# EAGLE design IGUINOBOARD (EAGLE 9.0.1)
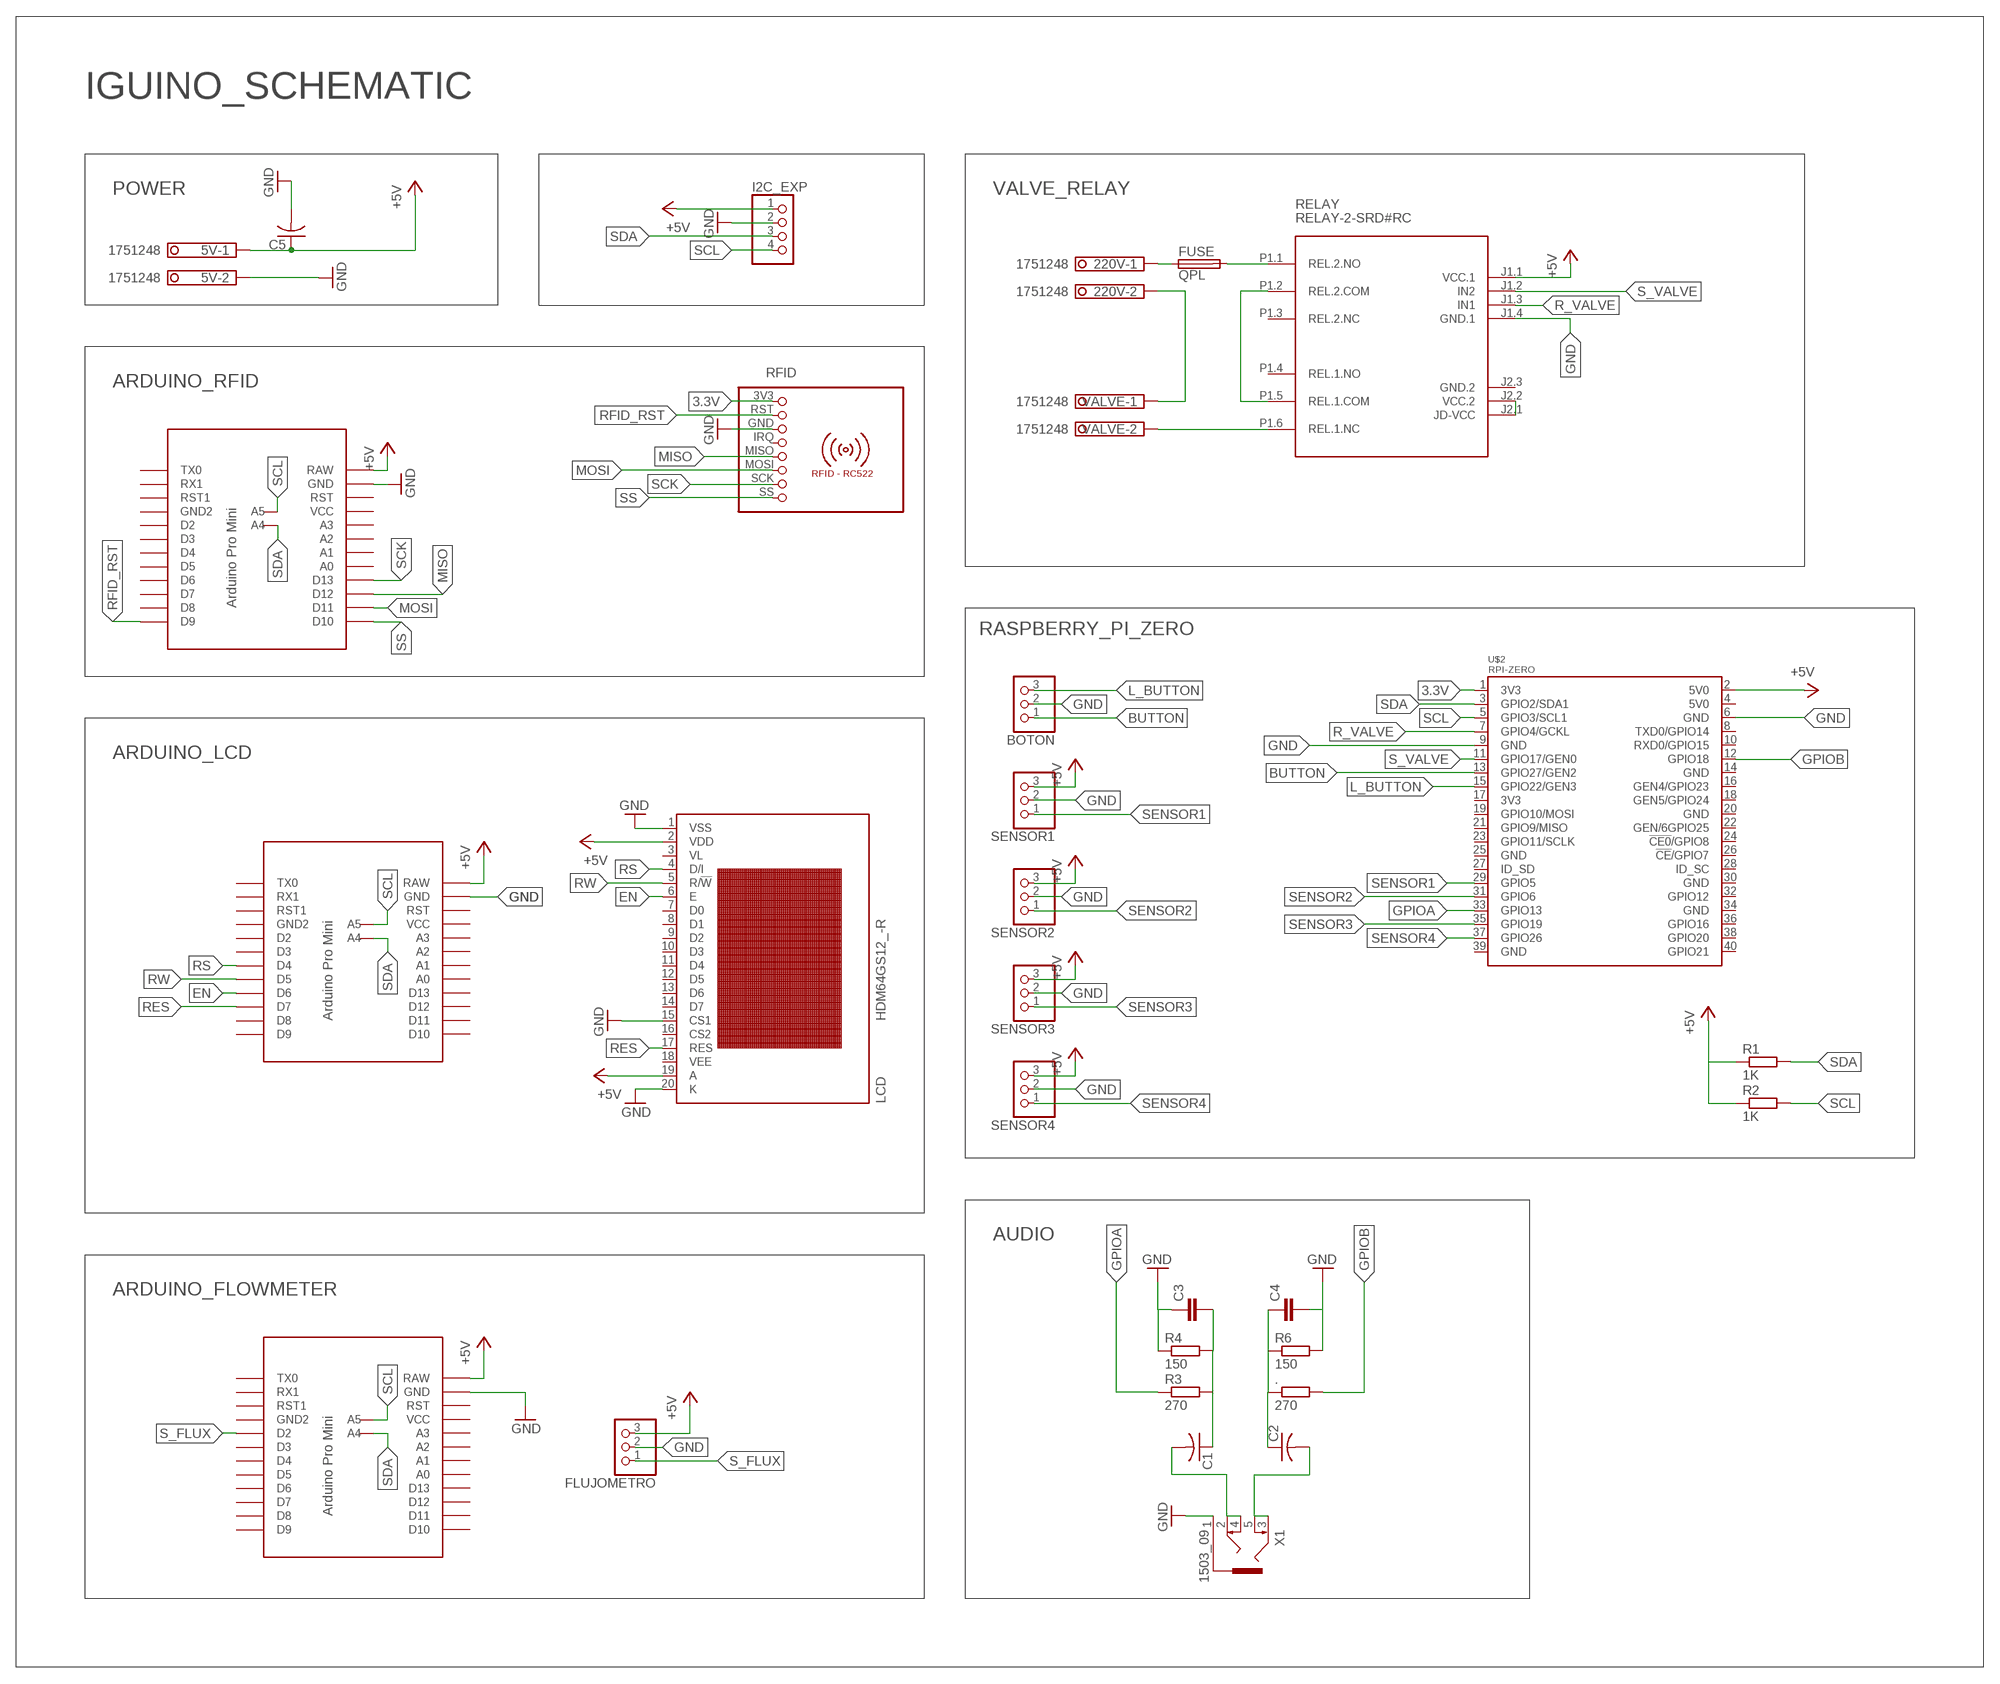
[diagram p0: schematic, sheet 1]

## Parts
5V  1751248  [1751248]
220V  1751248  [1751248]
.  270  R-EU_0204/7  [0204/7]
BOTON  PINHD-1X3  [1X03]
C1  C-US025-024X044  [C025-024X044]
C2  C-US025-024X044  [C025-024X044]
C3  C-EU025-030X050  [C025-030X050]
C4  C-EU025-030X050  [C025-030X050]
C5  C-US025-024X044  [C025-024X044]
FLUJOMETRO  PINHD-1X3  [1X03]
FUSE  QPL  [QPL]
I2C_EXP  PINHD-1X4  [1X04]
LCD  HDM64GS12_-R  [HDM64GS12_-R]
R1  1K  R-EU_0204/7  [0204/7]
R2  1K  R-EU_0204/7  [0204/7]
R3  270  R-EU_0204/7  [0204/7]
R4  150  R-EU_0204/7  [0204/7]
R6  150  R-EU_0204/7  [0204/7]
RELAY  RELAY-2-SRD#RC  [RELAY-2-SRD#RC]
RFID  RFID-RC522  [RFID-RC522]
SENSOR1  PINHD-1X3  [1X03]
SENSOR2  PINHD-1X3  [1X03]
SENSOR3  PINHD-1X3  [1X03]
SENSOR4  PINHD-1X3  [1X03]
U$1  PRO-MINI-2  [PRO-MINI-2]
U$2  RPI-ZERO  [RASP_PI_ZERO_BOARD_FULL]
U$5  PRO-MINI-2  [PRO-MINI-2]
U$6  PRO-MINI-2  [PRO-MINI-2]
VALVE  1751248  [1751248]
X1  1503_09  [1503_09]

## Nets
3.3V: RFID.3V3 U$2.1(3V3)
+5V: 5V.1 C5.1 FLUJOMETRO.3 I2C_EXP.1 LCD.2(VDD) LCD.19(A) R1.1 R2.1 RELAY.J1.1(VCC.1) SENSOR1.3 SENSOR2.3 SENSOR3.3 SENSOR4.3 U$1.RAW U$2.2(5V0) U$5.RAW U$6.RAW
BUTTON: BOTON.1 U$2.13(GPIO27/GEN2)
EN: LCD.6(E) U$5.D6
GND: 5V.2 BOTON.2 C3.1 C4.2 C5.2 FLUJOMETRO.2 I2C_EXP.2 LCD.1(VSS) LCD.15(CS1) LCD.20(K) R4.1 R6.2 RELAY.J1.4(GND.1) RFID.GND SENSOR1.2 SENSOR2.2 SENSOR3.2 SENSOR4.2 U$1.GND U$2.6(GND) U$2.9(GND) U$5.GND U$6.GND X1.1
GPIOA: R3.1 U$2.33(GPIO13)
GPIOB: ..2 U$2.12(GPIO18)
L_BUTTON: BOTON.3 U$2.15(GPIO22/GEN3)
MISO: RFID.MISO U$6.D12
MOSI: RFID.MOSI U$6.D11
N$1: RELAY.P1.6(REL.1.NC) VALVE.2
N$2: C1.1 C3.2 R3.2 R4.2
N$3: ..1 C2.1 C4.1 R6.1
N$4: C1.2 X1.2 X1.4
N$5: C2.2 X1.3 X1.5
N$11: 220V.1 FUSE.1
N$12: RELAY.P1.2(REL.2.COM) RELAY.P1.5(REL.1.COM)
N$14: FUSE.2 RELAY.P1.1(REL.2.NO)
N$15: 220V.2 VALVE.1
N$16: RELAY.J2.1(JD-VCC) RELAY.J2.2(VCC.2)
R_VALVE: RELAY.J1.3(IN1) U$2.7(GPIO4/GCKL)
RES: LCD.17(RES) U$5.D7
RFID_RST: RFID.RST U$6.D9
RS: LCD.4(D/I) U$5.D4
RW: LCD.5(R/!W) U$5.D5
S_FLUX: FLUJOMETRO.1 U$1.D2
S_VALVE: RELAY.J1.2(IN2) U$2.11(GPIO17/GEN0)
SCK: RFID.SCK U$6.D13
SCL: I2C_EXP.4 R2.2 U$1.A5 U$2.5(GPIO3/SCL1) U$5.A5 U$6.A5
SDA: I2C_EXP.3 R1.2 U$1.A4 U$2.3(GPIO2/SDA1) U$5.A4 U$6.A4
SENSOR1: SENSOR1.1 U$2.29(GPIO5)
SENSOR2: SENSOR2.1 U$2.31(GPIO6)
SENSOR3: SENSOR3.1 U$2.35(GPIO19)
SENSOR4: SENSOR4.1 U$2.37(GPIO26)
SS: RFID.SS U$6.D10
Unconnected: LCD.3(VL) LCD.7(D0) LCD.8(D1) LCD.9(D2) LCD.10(D3) LCD.11(D4) LCD.12(D5) LCD.13(D6) LCD.14(D7) LCD.16(CS2) LCD.18(VEE) RELAY.P1.3(REL.2.NC) RELAY.P1.4(REL.1.NO) RFID.IRQ U$1.A0 U$1.A1 U$1.A2 U$1.A3 U$1.D3 U$1.D4 U$1.D5 U$1.D6 U$1.D7 U$1.D8 U$1.D9 U$1.D10 U$1.D11 U$1.D12 U$1.D13 U$1.GND1(GND2) U$1.RST U$1.RST1 U$1.RX1 U$1.TX0 U$1.VCC U$2.4(5V0) U$2.8(TXD0/GPIO14) U$2.10(RXD0/GPIO15) U$2.14(GND) U$2.16(GEN4/GPIO23) U$2.17(3V3) U$2.18(GEN5/GPIO24) U$2.19(GPIO10/MOSI) U$2.20(GND) U$2.21(GPIO9/MISO) U$2.22(GEN/6GPIO25) U$2.23(GPIO11/SCLK) U$2.24(!CE0!/GPIO8) U$2.25(GND) U$2.26(!CE!/GPIO7) U$2.27(ID_SD) U$2.28(ID_SC) U$2.30(GND) U$2.32(GPIO12) U$2.34(GND) U$2.36(GPIO16) U$2.38(GPIO20) U$2.39(GND) U$2.40(GPIO21) U$5.A0 U$5.A1 U$5.A2 U$5.A3 U$5.D2 U$5.D3 U$5.D8 U$5.D9 U$5.D10 U$5.D11 U$5.D12 U$5.D13 U$5.GND1(GND2) U$5.RST U$5.RST1 U$5.RX1 U$5.TX0 U$5.VCC U$6.A0 U$6.A1 U$6.A2 U$6.A3 U$6.D2 U$6.D3 U$6.D4 U$6.D5 U$6.D6 U$6.D7 U$6.D8 U$6.GND1(GND2) U$6.RST U$6.RST1 U$6.RX1 U$6.TX0 U$6.VCC

## Notes on the sheet
- IGUINO_SCHEMATIC
- POWER | VALVE_RELAY
- ARDUINO_RFID
- RASPBERRY_PI_ZERO
- ARDUINO_LCD
- AUDIO
- ARDUINO_FLOWMETER

## Power pins joined to a net without a drawn wire
GND.2: RELAY.J2.3(GND.2)

## Library data of the parts
5V 220V VALVE = con-phoenix-350:1751248: MKDS 1/ 2-3,5 Printklemme Nennstrom: 10 A Bemessungsspannung: 160 V Raster: 3,5 mm Polzahl: 2 Montageart: Löten Anschlussart: Schraubanschluss Anschlussrichtung vom Leiter zur Platine: 0° Source: http://eshop.phoenixcontact.com .. 1751248.pdf; OC_FARNELL: unknown; OC_NEWARK: unknown
. R1-R4 R6 = rcl:R-EU_: RESISTOR, European symbol; SPICEPREFIX: R
BOTON FLUJOMETRO SENSOR1-SENSOR4 = pinhead:PINHD-1X3: PIN HEADER
C1 C2 C5 = rcl:C-US: CAPACITOR, American symbol; SPICEPREFIX: C
C3 C4 = rcl:C-EU: CAPACITOR, European symbol; SPICEPREFIX: C
FUSE = fuse:QPL: Fuseholder for Micro(TM) Fuse or Pico(R) II Fuses 281 005, 281 008 Source:www.littlefuse.com .. 281005A.PDF; OC_FARNELL: 1608231; OC_NEWARK: unknown
I2C_EXP = pinhead:PINHD-1X4: PIN HEADER
LCD = display-lcd-2:HDM64GS12_-R: HDM64GS12_-R 128 X 64 Dots Graphic Source: http://www.hantronix.com/down/64gs12-r.pdf; OC_FARNELL: unknown; OC_NEWARK: unknown
RELAY = diy-modules:RELAY-2-SRD#RC: 2-Channel Relay Module based on SRD-05VDC-SL-C relays Symbol with relays pins Click here to find device on ebay.com <http://www.ebay.com/sch/two+channel+relay+module+optocoupler+5v>
RFID = mfrc522-module:RFID-RC522: RFID-RC522 MFRC-522 based breakout board
U$1 U$5 U$6 = Arduino-clone2:PRO-MINI-2: Arduino Pro Mini Layout 2 Sparkfun.com
U$2 = rpi-zero:RPI-ZERO
X1 = con-lumberg-2:1503_09: Jack connectors according to JISC 6560, 3.5 mm Klinkeneinbaukupplung nach JISC 6560, 3,5 mm, 3-polig/ stereo, abgewinkelte Ausführung, mit 2 Öffnern und Lötaugen, für Leiterplatten Rückseitenmontage Source: http://www.lumberg.com/Produkte/PDFs/1503_09.pdf; OC_FARNELL: 1243244; OC_NEWARK: unknown

## Board
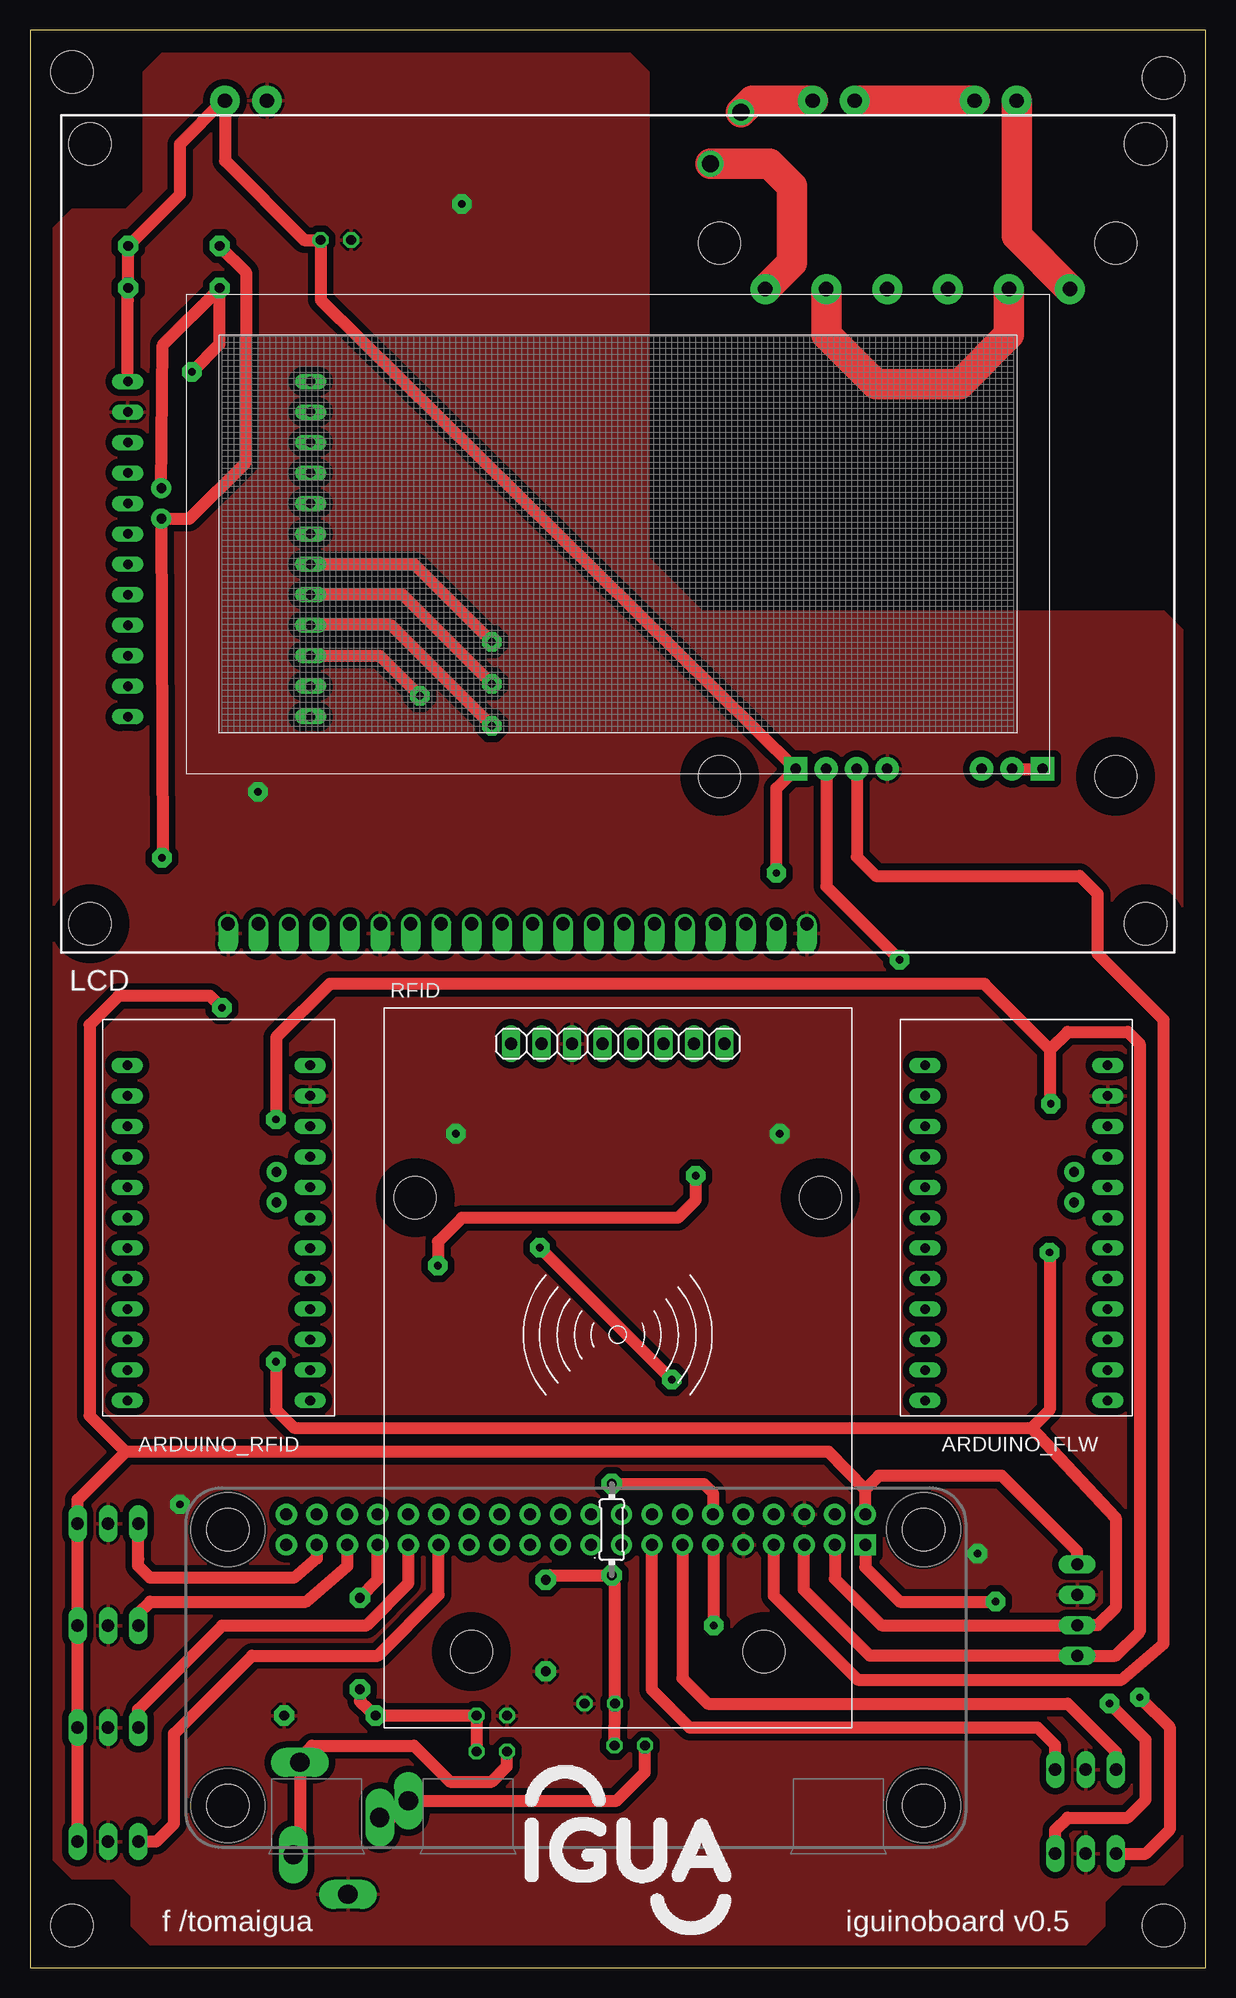
[diagram p1: board, top side]
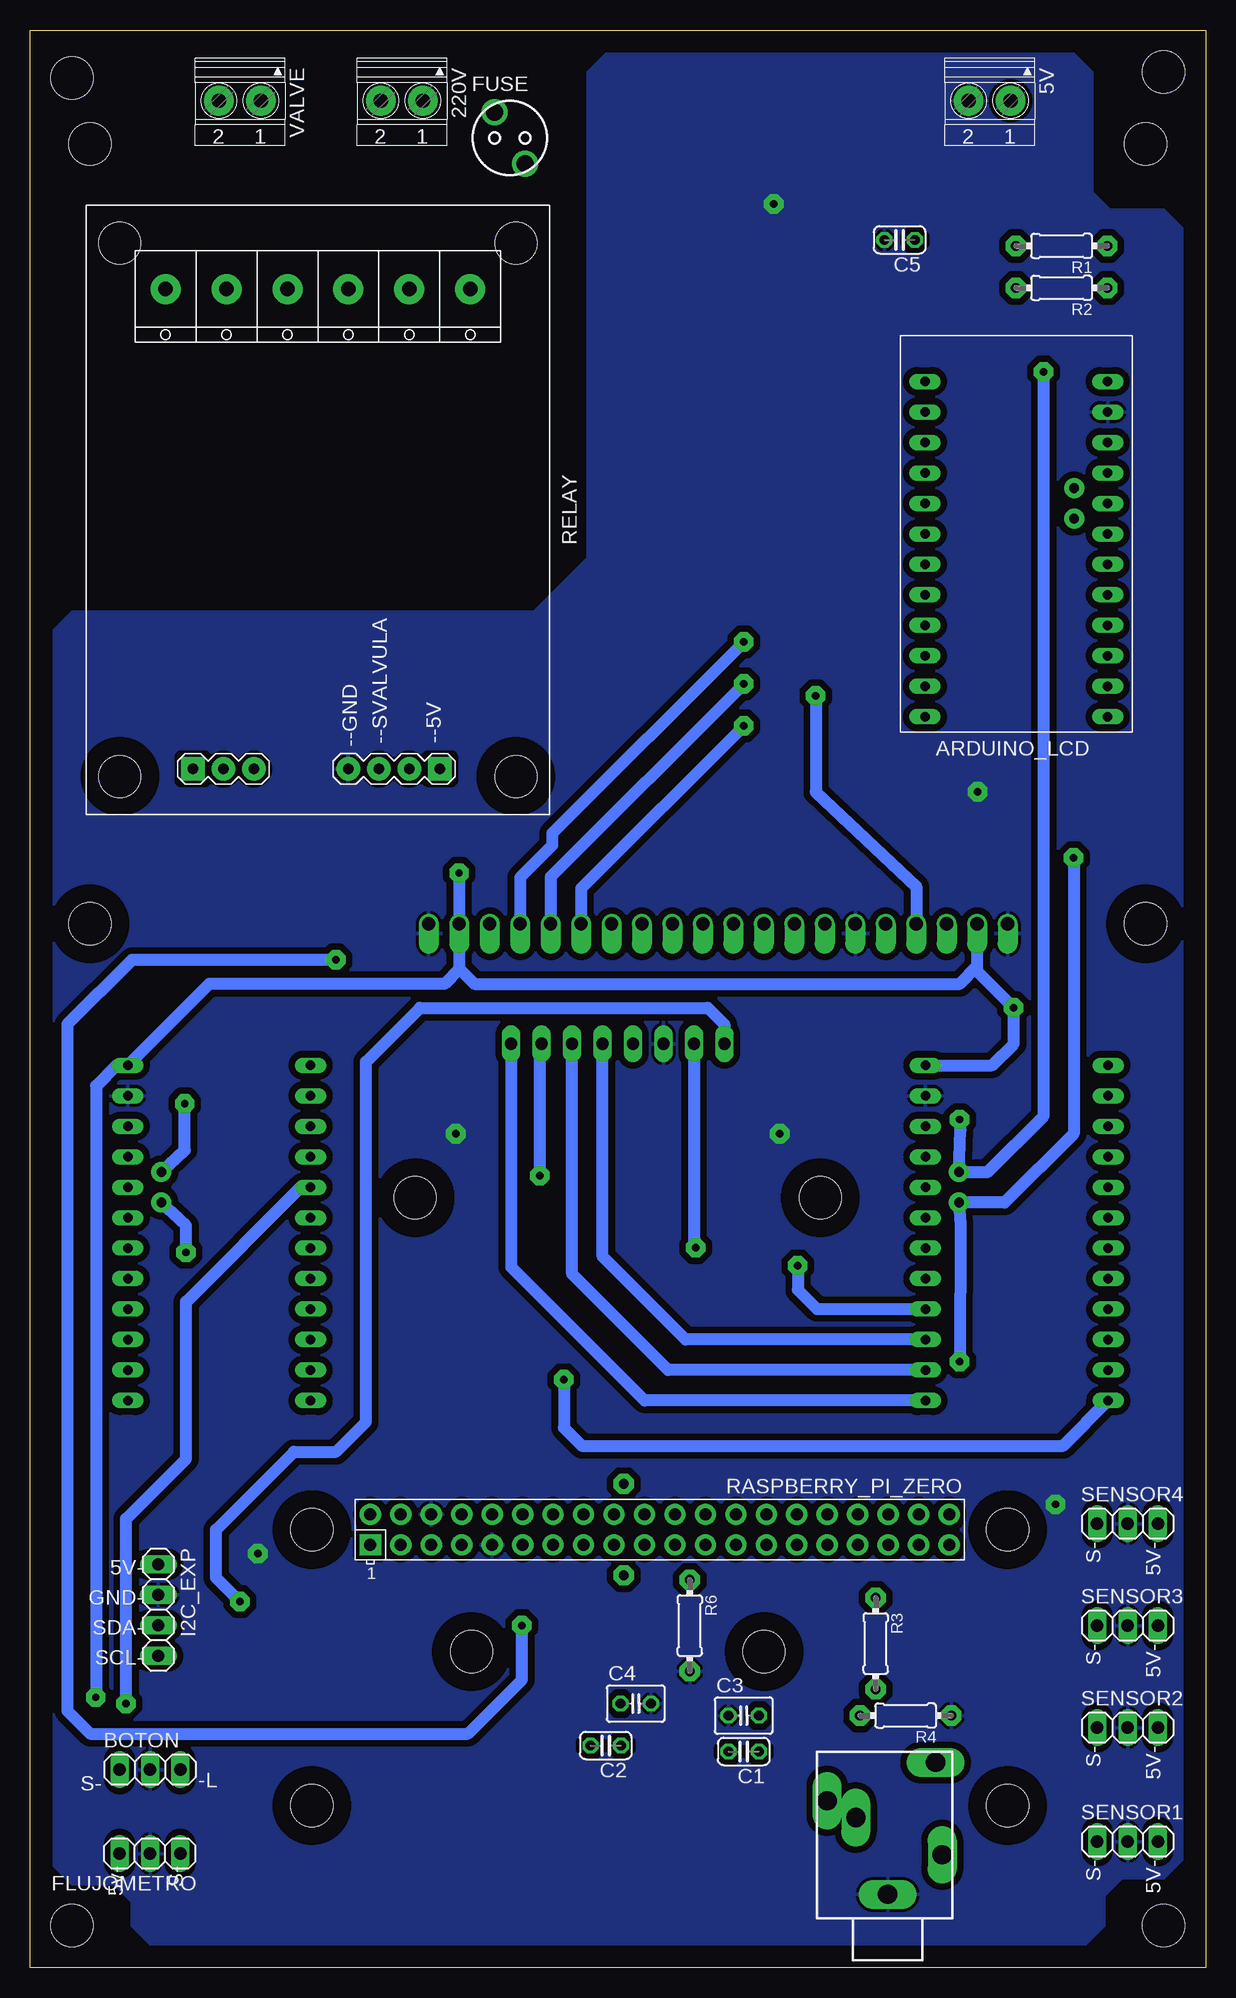
[diagram p2: board, bottom side, seen from below]

Size 98 x 161.5 mm. Coordinates in mm from the lower left corner, seen from the top.
Outline: 0,0 98,0 98,161.5 0,161.5 0,0
Copper layers (1*16): Top 0.035mm / dielectric 1.5mm / Bottom 0.035mm
Design rules "default *": minimum track width 40mil, minimum drill 40mil, track to track 22mil, track to pad 22mil, pad to pad 22mil, via to via 22mil, smd to smd 6mil, copper to edge 60mil, drill to drill 8mil, minimum pad ring 10mil, minimum via ring 8mil, stop-mask expansion 4mil, vias tented up to drill 0mil, thermal gap 10mil
Holes 3.5 mm at 3.5,3.5 94.5,3.5 94.5,157.5 3.5,158

### Footprints (pad centres in the part's own frame; a part is rotated, then mirrored left to right if it is on the bottom)
1751248 = drill 1.194 pad 2.489: 1 -1.75,-0.1; 2 1.75,-0.1
0204/7 = drill 0.813 pad 1.676 octagon: 1 -3.81,0; 2 3.81,0
1X03 = drill 1.016 long: 1 -2.54,0; 2 0,0; 3 2.54,0
C025-024X044 = drill 0.813 octagon: 1 -1.27,0; 2 1.27,0
C025-030X050 = drill 0.813 octagon: 1 -1.27,0; 2 1.27,0
QPL = drill 1.4 pad 2.184: 1 -1.27,2.139; 2 1.27,-2.139
1X04 = drill 1.016 long: 1 -3.81,0; 2 -1.27,0; 3 1.27,0; 4 3.81,0
HDM64GS12_-R = drill 1.1 offset: 1 15.76,-32.5; 2 13.22,-32.5; 3 10.68,-32.5; 4 8.14,-32.5; 5 5.6,-32.5; 6 3.06,-32.5; 7 0.52,-32.5; 8 -2.02,-32.5; 9 -4.56,-32.5; 10 -7.1,-32.5; 11 -9.64,-32.5; 12 -12.18,-32.5; 13 -14.72,-32.5; 14 -17.26,-32.5; 15 -19.8,-32.5; 16 -22.34,-32.5; 17 -24.88,-32.5; 18 -27.42,-32.5; 19 -29.96,-32.5; 20 -32.5,-32.5 | hole 3.5: -44,-32.5; 44,-32.5; -44,32.5; 44,32.5
RELAY-2-SRD#RC = drill 0.889 pad 1.956 square: J1.1 21.59,10.16; J2.1 21.59,-10.414 | drill 0.889 pad 1.956: J1.2 21.59,7.62; J1.3 21.59,5.08; J1.4 21.59,2.54; J2.2 21.59,-7.874; J2.3 21.59,-5.334 | drill 1.2 pad 2.5: P1.1 -18.415,12.7; P1.2 -18.415,7.62; P1.3 -18.415,2.54; P1.4 -18.415,-2.54; P1.5 -18.415,-7.62; P1.6 -18.415,-12.7 | hole 3.5: -22.225,16.51; 22.225,16.51; 22.225,-16.51; -22.225,-16.51
RFID-RC522 = drill 1.016 long: 3V3 -8.89,0; GND -3.81,0; IRQ -1.27,0; MISO 1.27,0; MOSI 3.81,0; RST -6.35,0; SCK 6.35,0; SS 8.89,0 | hole 3.5: -12.192,-50.673; 12.192,-50.673; -16.891,-12.827; 16.891,-12.827
PRO-MINI-2 = drill 0.8 long: A0 6.35,2.54; A1 6.35,0; A2 6.35,-2.54; A3 6.35,-5.08; D2 -8.89,2.54; D3 -8.89,0; D4 -8.89,-2.54; D5 -8.89,-5.08; D6 -8.89,-7.62; D7 -8.89,-10.16; D8 -8.89,-12.7; D9 -8.89,-15.24; D10 6.35,-15.24; D11 6.35,-12.7; D12 6.35,-10.16; D13 6.35,-7.62; GND 6.35,10.16; GND1 -8.89,5.08; RAW 6.35,12.7; RST 6.35,7.62; RST1 -8.89,7.62; RX1 -8.89,10.16; TX0 -8.89,12.7; VCC 6.35,5.08 | drill 0.8 pad 1.676: A4 3.556,1.27; A5 3.556,3.81
RASP_PI_ZERO_BOARD_FULL = drill 1 pad 1.778 square: 1 8.37,25.23 | drill 1 pad 1.778: 2 8.37,27.77; 3 10.91,25.23; 4 10.91,27.77; 5 13.45,25.23; 6 13.45,27.77; 7 15.99,25.23; 8 15.99,27.77; 9 18.53,25.23; 10 18.53,27.77; 11 21.07,25.23; 12 21.07,27.77; 13 23.61,25.23; 14 23.61,27.77; 15 26.15,25.23; 16 26.15,27.77; 17 28.69,25.23; 18 28.69,27.77; 19 31.23,25.23; 20 31.23,27.77; 21 33.77,25.23; 22 33.77,27.77; 23 36.31,25.23; 24 36.31,27.77; 25 38.85,25.23; 26 38.85,27.77; 27 41.39,25.23; 28 41.39,27.77; 29 43.93,25.23; 30 43.93,27.77; 31 46.47,25.23; 32 46.47,27.77; 33 49.01,25.23; 34 49.01,27.77; 35 51.55,25.23; 36 51.55,27.77; 37 54.09,25.23; 38 54.09,27.77; 39 56.63,25.23; 40 56.63,27.77 | hole 3.5: 3.5,3.5; 3.5,26.5; 61.5,3.5; 61.5,26.5
1503_09 = drill 1.6 pad 2 long: 1 0,-2.1; 2 -4.55,-5.4; 3 5.05,-9.9; 4 -4,-13.1; 5 2.65,-8.5

### Placement (x,y rotation side)
5V  18,155.5 180 bottom
220V  67,155.5 180 bottom
.  48.5,36.5 90 top
BOTON  88,16.5 0 bottom
C1  38.5,18 180 bottom
C2  50,18.5 180 bottom
C3  38.5,21 0 bottom
C4  47.5,22 0 bottom
C5  25.5,144 180 bottom
FLUJOMETRO  88,9.5 180 bottom
FUSE  58,152.5 0 bottom
I2C_EXP  87.3,29.8 270 bottom
LCD  49,119.5 0 top
R1  12,143.5 180 bottom
R2  12,140 180 bottom
R3  27.5,27 270 bottom
R4  25,21 180 bottom
R6  43,28.5 270 bottom
RELAY  74,121.5 270 bottom
RFID  49,77 0 top
SENSOR1  6.5,10.5 0 bottom
SENSOR2  6.5,20 0 bottom
SENSOR3  6.5,28.5 0 bottom
SENSOR4  6.5,37 0 bottom
U$1  83.5,62.5 0 top
U$2  78,10 0 bottom
U$5  14.5,119.5 0 bottom
U$6  17,62.5 0 top
VALVE  80.5,155.5 180 bottom
X1  26.5,4 180 bottom

### Tracks (layer width: path | path; a pad name or v marks a point on that pad's centre or on a via)
3.3V  (via drill 0.6 pad 1.6)
  Top 1.016: U$2.1 69.63,33.37 72.5,30.5 v80.5,30.5
  Bottom 1.016: v80.5,30.5 82.5,32.5 82.5,36.5 76,43 72.5,43 70,45.5 70,75.5 65.5,80 41.5,80 40.11,78.61 RFID.3V3
+5V  (via drill 0.6 pad 1.6)
  Top 1.016: U$2.2 69.63,39.87 | 69.63,39.87 66.6,43 7.96,43 | 7.96,43 4.96,46 4.96,78.57 7.39,81 15,81 v16,80 | SENSOR1.3 SENSOR2.3 SENSOR3.3 SENSOR4.3 3.96,39 7.96,43 | 69.63,39.87 70.76,41 81,41 87.3,34.7 I2C_EXP.1 | U$5.RAW 8.15,138.96 R2.1 R1.1 12.5,147.81 12.5,152 16.1,155.6 5V.1 16.25,150.6 22.85,144 C5.1 24.23,139.02 RELAY.J1.1 62.22,98.29 v62.22,91.22 | v92.52,22.52 95,20.04 95,11.5 93,9.5 FLUJOMETRO.3
  Bottom 1.016: 62.22,83.28 62.22,83.22 63.44,82 83.05,82 U$1.RAW 90.8,75.2 92.5,73.5 92.5,22.54 v92.52,22.52 | 62.22,83.28 LCD.2 v62.22,91.22 | 62.22,83.28 60.94,82 20.5,82 19.04,83.46 | 19.04,83.46 LCD.19 | U$6.RAW 17.8,75.2 16,77 v16,80 18.96,82.96 19.04,83.46
BUTTON
  Top 1.016: U$2.13 54.39,24.11 56.5,22 86.5,22 90.54,17.96 BOTON.1
EN  (via drill 0.6 pad 1.6)
  Top 1.016: v38.5,103.5 30.12,111.88 U$5.D6
  Bottom 1.016: v38.5,103.5 52.06,89.94 LCD.6
GND  (via drill 0.6 pad 1.6)
  other vias: 36,147 12.5,38.6 19,98 62.5,69.5 35.5,69.5 79,34.5
  pour Bottom: 2,9 3.5,7.5 7,7.5 8.5,6 8.5,3.5 10,2 88,2 89.5,3.5 89.5,5.5 91,7 94.5,7 96,8.5 96,111.5 94.5,113 56,113 51.5,117.5 51.5,158 50,159.5 11,159.5 9.5,158 9.5,148 8,146.5 3.5,146.5 2,145
  pour Top: 2,9 3.5,7.5 7,7.5 8.5,6 8.5,3.5 10,2 88,2 89.5,3.5 89.5,5.5 91,7 94.5,7 96,8.5 96,111.5 94.5,113 56,113 51.5,117.5 51.5,158 50,159.5 11,159.5 9.5,158 9.5,148 8,146.5 3.5,146.5 2,145
GPIOA
  Top 1.016: R3.1 28.99,32.32 U$2.33
GPIOB
  Top 1.016: U$2.12 56.93,39.57 56.19,40.31 ..2
L_BUTTON
  Top 1.016: U$2.15 51.85,23.15 55,20 84,20 85.46,18.54 BOTON.3
MISO
  Bottom 1.016: RFID.MISO 50.27,59.27 43.34,52.34 U$6.D12
MOSI
  Bottom 1.016: RFID.MOSI 52.81,57.81 44.8,49.8 U$6.D11
N$1
  Top 2.54: RELAY.P1.6 82.25,144.37 VALVE.2
N$2
  Top 1.016: R3.2 27.5,22.19 R4.2 C3.2 C1.1
N$3
  Top 1.016: R6.1 43.38,32.69 ..1 48.27,32.46 48.77,31.96 C4.1 C2.1
N$4
  Top 1.016: X1.2 22.5,9.95 X1.4 22.5,17.5 23.5,18.5 32,18.5 35,15.5 38.5,15.5 39.77,16.77 C1.2
N$5
  Top 1.016: X1.5 30.15,12.5 X1.3 48.9,13.9 51.27,16.27 C2.2
N$11
  Top 2.54: FUSE.1 60.23,155.6 220V.1
N$12
  Top 2.54: RELAY.P1.2 66.38,136.12 70.5,132 77.5,132 81.62,136.12 RELAY.P1.5
N$14
  Top 2.54: FUSE.2 61.64,150.36 63.5,148.5 63.5,142.12 RELAY.P1.1
N$15
  Top 2.54: 220V.2 VALVE.1
N$16
  Top 1.016: RELAY.J2.2 RELAY.J2.1
R_VALVE
  Top 1.016: RELAY.J1.3 68.92,92.58 70.5,91 87.5,91 89,89.5 89,84.5 94.5,79 94.5,27 91,24 69.01,24 62.01,31 U$2.7
RES  (via drill 0.6 pad 1.6)
  Top 1.016: U$5.D7 29.16,109.34 v32.5,106
  Bottom 1.016: v32.5,106 32.5,98 24.12,90.12 LCD.17
RFID_RST  (via drill 0.6 pad 1.6)
  Top 1.016: v42.5,60 v53.5,49
  Bottom 1.016: U$6.D9 11.87,43.5 52,43.5 53.5,45 v53.5,49 | RFID.RST 42.65,60.15 v42.5,60
RS  (via drill 0.6 pad 1.6)
  Top 1.016: U$5.D4 32.04,116.96 v38.5,110.5
  Bottom 1.016: v38.5,110.5 54.47,94.53 54.47,93.52 57.14,90.85 LCD.4
RW  (via drill 0.6 pad 1.6)
  Top 1.016: U$5.D5 31.08,114.42 v38.5,107
  Bottom 1.016: v38.5,107 54.6,90.9 LCD.5
S_FLUX  (via drill 0.6 pad 1.6)
  Top 1.016: v90,22 93,19 93,14 91.5,12.5 86.5,12.5 85.46,11.46 FLUJOMETRO.1
  Bottom 1.016: U$1.D2 75.46,65.04 85,55.5 85,42.4 90,37.4 v90,22
S_VALVE  (via drill 0.6 pad 1.6)
  Top 1.016: RELAY.J1.2 66.38,90.12 v72.5,84 | v57,28.5 57,34.66 U$2.11
  Bottom 1.016: v72.5,84 89.5,84 94.89,78.61 94.89,21.39 93,19.5 61.5,19.5 57,24 v57,28.5
SCK  (via drill 0.6 pad 1.6)
  Top 1.016: v55.5,66 55.5,64 54,62.5 36,62.5 34,60.5 v34,58.5
  Bottom 1.016: U$6.D13 32.38,54.88 34,56.5 v34,58.5 | v55.5,66 55.5,75.85 RFID.SCK
SCL  (via drill 0.6 pad 1.6)
  Top 1.016: v13.5,133 15.81,135.31 R2.2 11.07,135.26 U$5.A5 | 85.04,76.54 86.5,78 91.5,78 92.5,77 92.5,28 90.49,25.99 I2C_EXP.4 70.01,25.99 64.5,31.5 64.5,34.68 U$2.5 | 85.04,76.54 79.58,82 25,82 20.54,77.54 20.54,76.24 v20.5,70.7 | 85.04,76.54 85.04,72.06 v85.1,72
  Bottom 1.016: v13.5,133 13.5,71 18.19,66.31 U$6.A5 20.43,69.77 v20.5,70.7 | U$1.A5 85.1,68.14 v85.1,72
SDA  (via drill 0.6 pad 1.6)
  Top 1.016: U$5.A4 13.27,120.77 18,125.5 18,141.31 R1.2 | 11.5,120.73 U$5.A4 | v85,59.6 85,46.5 83.5,45 | v20.5,50.5 20.5,46.5 22,45 83.5,45 | 83.5,45 90.5,37.5 90.5,30 89.03,28.53 I2C_EXP.3 70.97,28.53 67.09,32.41 U$2.3 | U$5.A4 11.07,93.07 v11,92.5
  Bottom 1.016: v20.5,50.5 20.43,61.93 U$6.A4 16.73,63.77 11,69.5 v11,92.5 | v85,59.6 85,61.84 U$1.A4
SENSOR1
  Top 1.016: SENSOR1.1 10.5,10.5 12,12 12,19.5 18.5,26 29,26 34.07,31.07 U$2.29
SENSOR2
  Top 1.016: SENSOR2.1 9.04,21.46 9,21.5 16,28.5 28,28.5 31.53,32.03 U$2.31
SENSOR3
  Top 1.016: U$2.35 26.45,33.45 23,30.5 10,30.5 9.04,29.54 SENSOR3.1
SENSOR4
  Top 1.016: U$2.37 23.91,34.09 22,32.5 10,32.5 9,33.5 9.04,34.04 SENSOR4.1
SS
  Bottom 1.016: U$6.D10 46.76,47.26 57.89,58.39 RFID.SS

### Text on the board
tPlace: ARDUINO_RFID | ARDUINO_FLW | f /tomaigua | iguinoboard v0.5
bPlace: --SVALVULA | --GND | --5V | ARDUINO_LCD | RASPBERRY_PI_ZERO | 5V- | S- | 5V- | GND- | SDA- | 5V- | S- | SCL- | 5V- | S- | S- | -L | 5V- | S- | S- | 5v-